# Altium project logi-cam-mt9v.PrjPcb
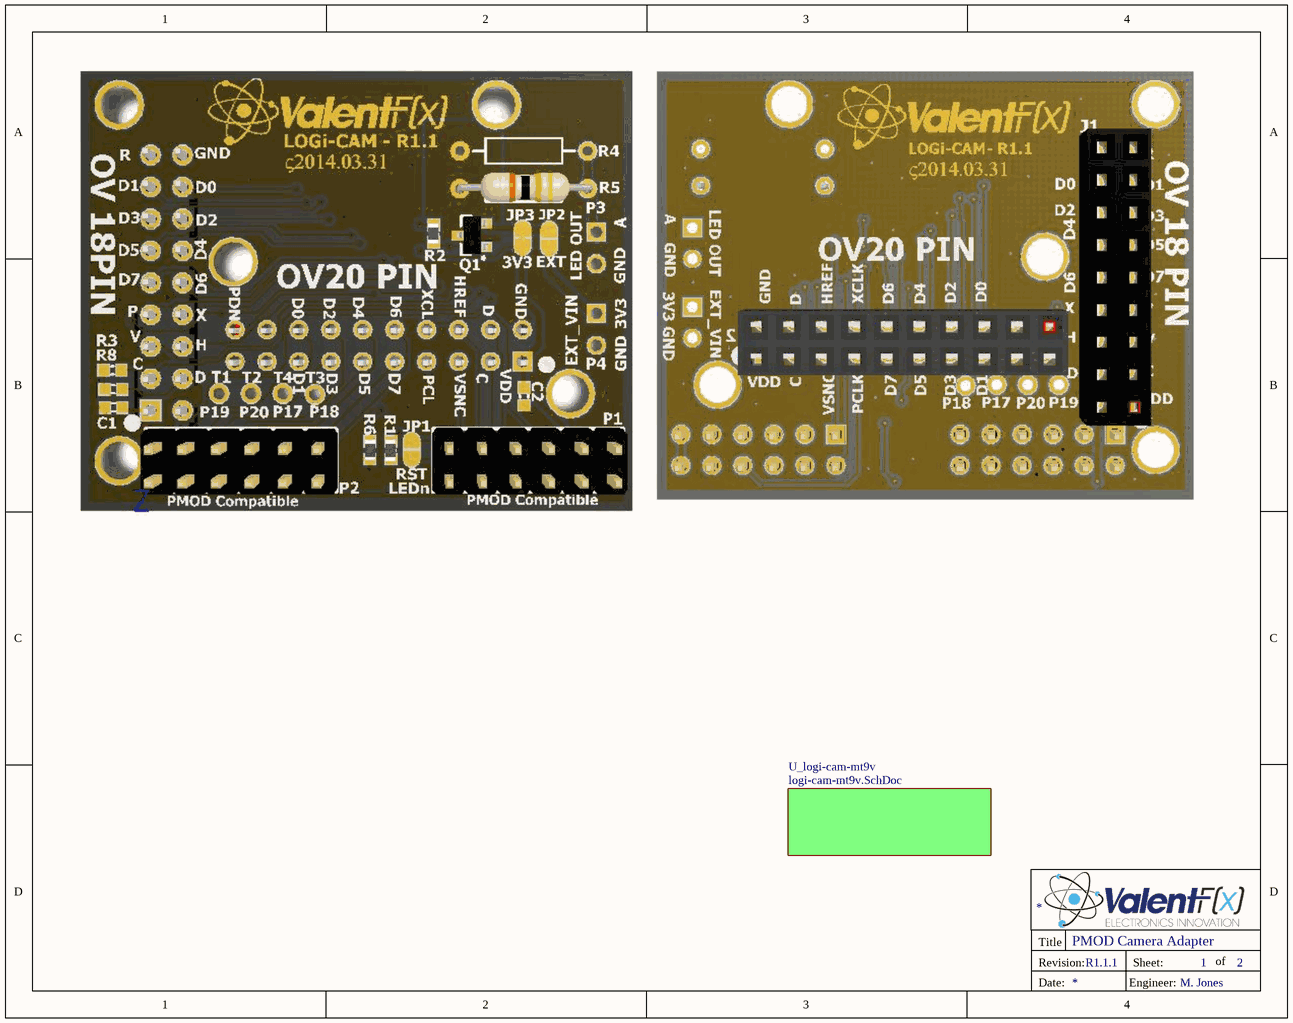
[diagram p0: logi-cam-mt9v-top.SchDoc]
PrjEngineer: M. Jones; PrjRevision: R1.1.1
2 sheets, 44 parts. Net scope: global (net labels, ports and power ports of the same name join across sheets).
Board file: logi-cam-mt9v.PcbDoc
Sheets:
  logi-cam-mt9v-top.SchDoc
    U_logi-cam-mt9v = logi-cam-mt9v.SchDoc

## Sheet logi-cam-mt9v-top.SchDoc: PMOD Camera Adapter
size A; Engineer: Michael Jones; DocumentNumber: 1; Revision: RA.1; SheetNumber: 1; SheetTotal: 2; ProjectName: OV7725

### Sub-sheets
U_logi-cam-mt9v = logi-cam-mt9v.SchDoc: no entries

### Notes on the sheet
- Title
- Revision:
- Sheet:
- of
- Date:
- Engineer:

## Sheet logi-cam-mt9v.SchDoc: PMOD Camera Adapter
size B; Engineer: Michael Jones; DocumentNumber: 2; Revision: RA.1; SheetNumber: 2; SheetTotal: 2; ProjectName: OV7725
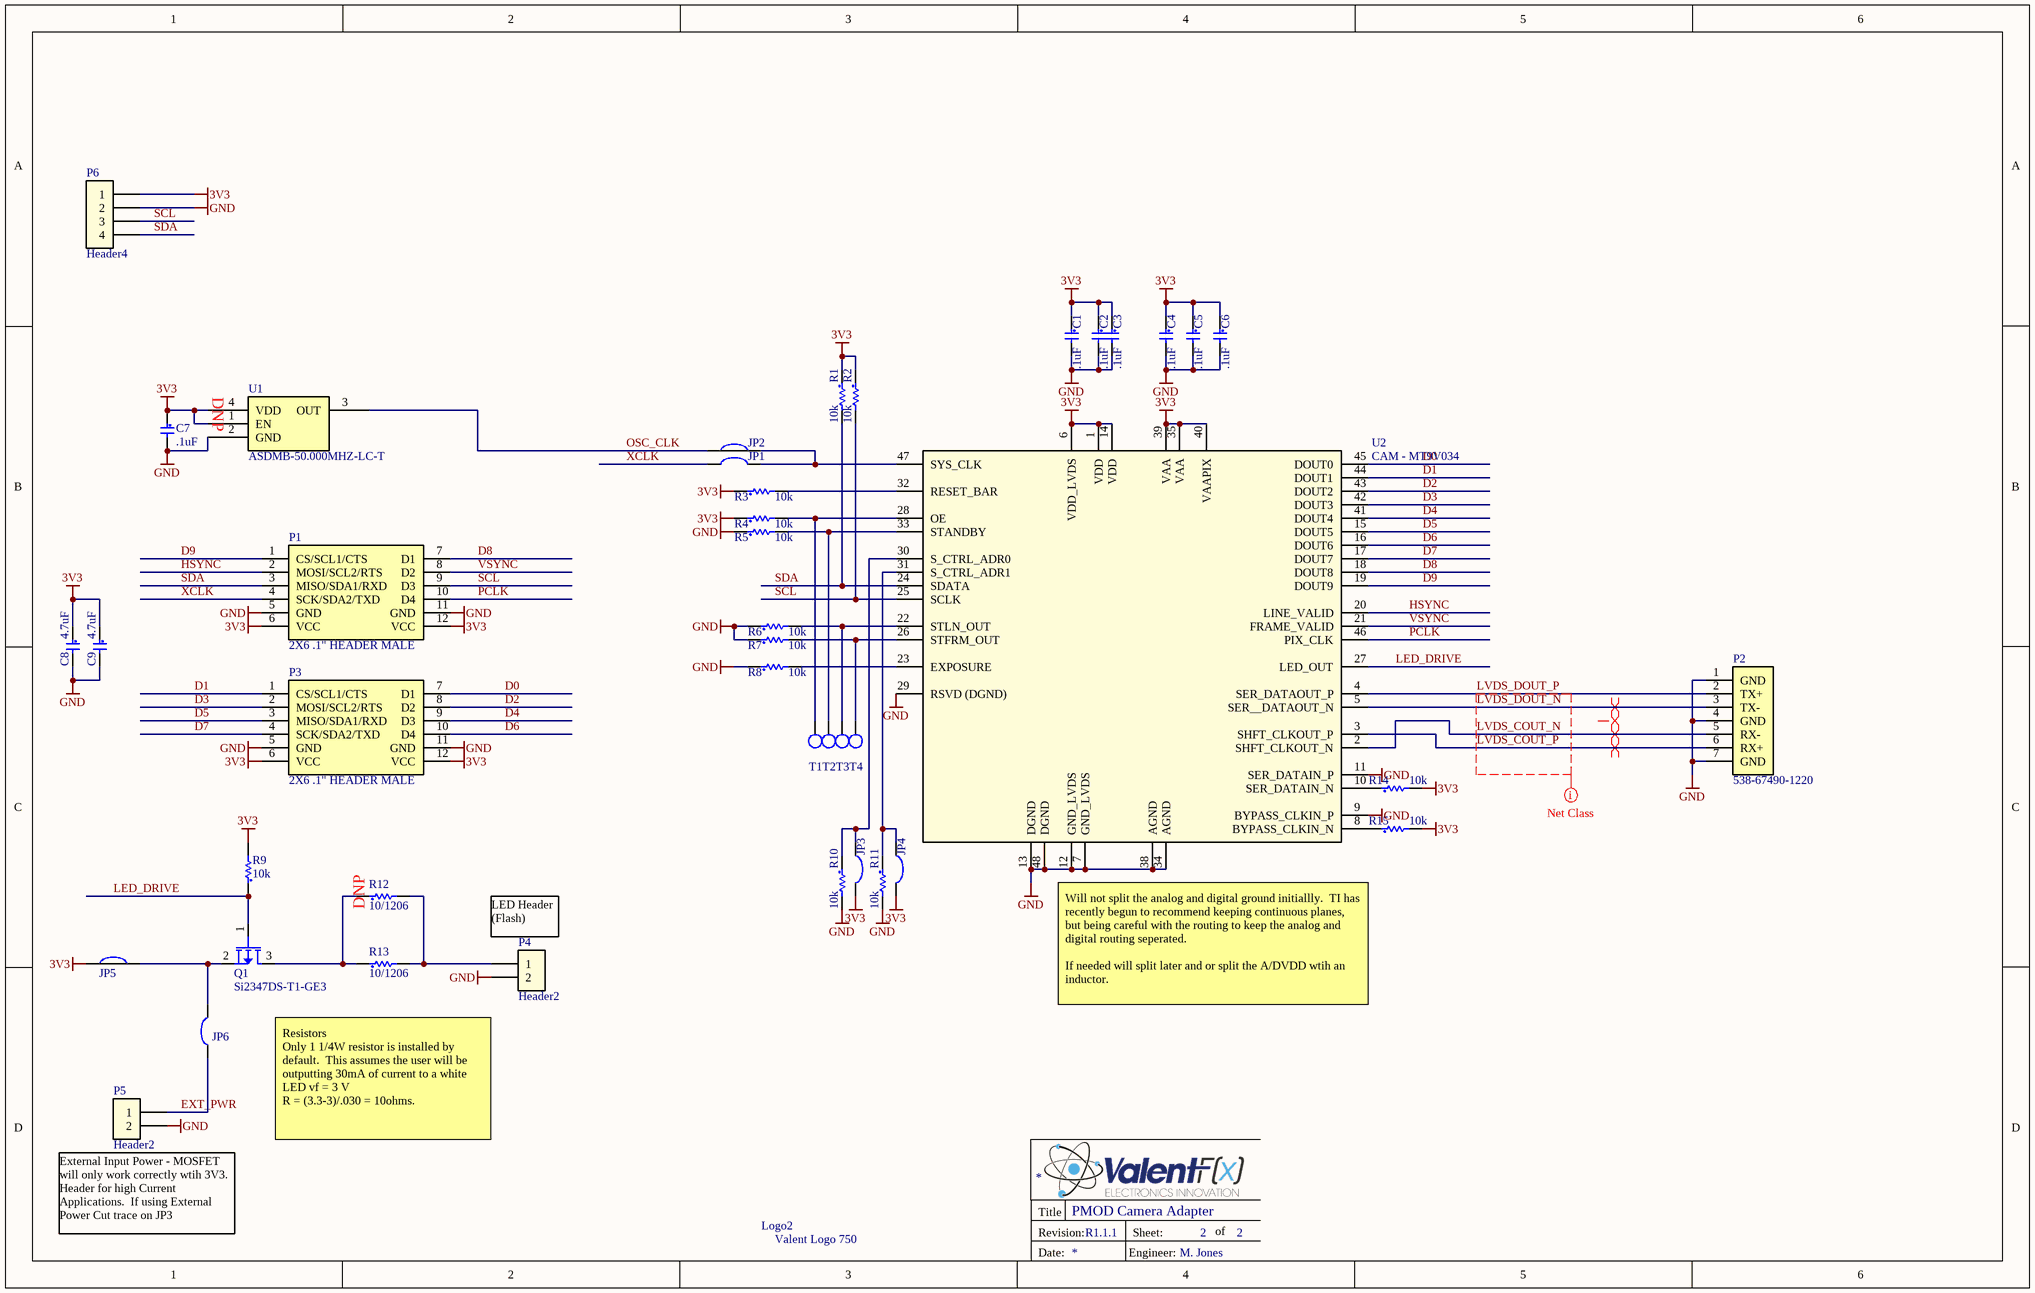
[diagram p1: logi-cam-mt9v.SchDoc]

### Parts
C1  .1uF  [C0603]
C2  .1uF  [C0603]
C3  .1uF  [C0603]
C4  .1uF  [C0603]
C5  .1uF  [C0603]
C6  .1uF  [C0603]
C7  .1uF  [C0603]
C8  4.7uF  [C0603 - Marked]
C9  4.7uF  [C0603 - Marked]
JP1  Solder Jumper  [SOLDER_JUMPER]  (value not drawn)  (no BOM)
JP2  Solder Jumper-NC  [SOLDER_JUMPER-NC]  (value not drawn)  (net tie, no BOM)
JP3  Solder Jumper  [SOLDER_JUMPER]  (value not drawn)  (no BOM)
JP4  Solder Jumper  [SOLDER_JUMPER]  (value not drawn)  (no BOM)
JP5  Solder Jumper-NC  [SOLDER_JUMPER-NC]  (value not drawn)  (net tie, no BOM)
JP6  Solder Jumper  [SOLDER_JUMPER]  (value not drawn)  (no BOM)
Logo2  Valent Logo 750  [VALENTFX_750-SolderMask-BOT]  (no BOM)
P1  2X6 .1" HEADER MALE  [PMOD HEADER - Male Vertical]
P2  Supplier Part Number 1: 538-67490-1220  [SATA - 67490-3220]  (hidden comment: SATA - 67490-1220)
P3  2X6 .1" HEADER MALE  [PMOD HEADER - Male Vertical]
P4  Header2  [HEADER_2_40_100 THRU SIP]  (no BOM)
P5  Header2  [HEADER_2_40_100 THRU SIP]  (no BOM)
P6  Header4  [HEADER_4_40_100 THRU SIP - duplicate]
Q1  Si2347DS-T1-GE3  [sot-23]
R1  10k  [R0603]
R2  10k  [R0603]
R3  10k  [R0603]
R4  10k  [R0603]
R5  10k  [R0603]
R6  10k  [R0603]
R7  10k  [R0603]
R8  10k  [R0603]
R9  10k  [R0603]
R10  10k  [R0603]
R11  10k  [R0603]
R12  10/1206  [R1206]
R13  10/1206  [R1206]
R14  10k  [R0603]
R15  10k  [R0603]
T1  Test Point  [Tp 18-33]  (value not drawn)  (no BOM)
T2  Test Point  [Tp 18-33]  (value not drawn)  (no BOM)
T3  Test Point  [Tp 18-33]  (value not drawn)  (no BOM)
T4  Test Point  [Tp 18-33]  (value not drawn)  (no BOM)
U1  ASDMB-50.000MHZ-LC-T  [ASDMB - osc]
U2  CAM - MT9V034  [CAM - MT9V034 - easier]

### Nets
3V3: C1.1 C2.1 C3.1 C4.1 C5.1 C6.1 C7.1 C8.1 C9.1 JP3.2 JP4.2 JP5.1 P1.6(VCC) P1.12(VCC) P3.6(VCC) P3.12(VCC) P6.1 R1.1 R2.1 R3.1 R4.1 R9.2 R14.2 R15.2 U1.1(EN) U1.4(VDD) U2.1(VDD) U2.6(VDD_LVDS) U2.14(VDD) U2.35(VAA) U2.39(VAA) U2.40(VAAPIX)
GND: C1.2 C2.2 C3.2 C4.2 C5.2 C6.2 C7.2 C8.2 C9.2 P1.5(GND) P1.11(GND) P2.1(GND) P2.4(GND) P2.7(GND) P3.5(GND) P3.11(GND) P4.2 P5.2 P6.2 R5.1 R6.1 R7.1 R8.1 R10.2 R11.2 U1.2(GND) U2.7(GND_LVDS) U2.9(BYPASS_CLKIN_P) U2.11(SER_DATAIN_P) U2.12(GND_LVDS) U2.13(DGND) U2.29(RSVD_(DGND)) U2.34(AGND) U2.38(AGND) U2.48(DGND)
D0: P3.7(D1) U2.45(DOUT0)
D1: P3.1(CS/SCL1/CTS) U2.44(DOUT1)
D2: P3.8(D2) U2.43(DOUT2)
D3: P3.2(MOSI/SCL2/RTS) U2.42(DOUT3)
D4: P3.9(D3) U2.41(DOUT4)
D5: P3.3(MISO/SDA1/RXD) U2.15(DOUT5)
D6: P3.10(D4) U2.16(DOUT6)
D7: P3.4(SCK/SDA2/TXD) U2.17(DOUT7)
D8: P1.7(D1) U2.18(DOUT8)
D9: P1.1(CS/SCL1/CTS) U2.19(DOUT9)
EXT_PWR: JP6.1 P5.1
HSYNC: P1.2(MOSI/SCL2/RTS) U2.20(LINE_VALID)
LED_DRIVE: Q1.1(G) R9.1 U2.27(LED_OUT)
LVDS_COUT_N: P2.5(RX-) U2.2(SHFT_CLKOUT_N)
LVDS_COUT_P: P2.6(RX+) U2.3(SHFT_CLKOUT_P)
LVDS_DOUT_N: P2.3(TX-) U2.5(SER__DATAOUT_N)
LVDS_DOUT_P: P2.2(TX+) U2.4(SER_DATAOUT_P)
OSC_CLK: JP2.1 U1.3(OUT)
PCLK: P1.10(D4) U2.46(PIX_CLK)
SCL: P1.9(D3) P6.3 R2.2 U2.25(SCLK)
SDA: P1.3(MISO/SDA1/RXD) P6.4 R1.2 U2.24(SDATA)
VSYNC: P1.8(D2) U2.21(FRAME_VALID)
XCLK: JP1.1 P1.4(SCK/SDA2/TXD)
NetJP1_2: JP1.2 JP2.2 U2.47(SYS_CLK)
NetJP3_1: JP3.1 R10.1 U2.30(S_CTRL_ADR0)
NetJP4_1: JP4.1 R11.1 U2.31(S_CTRL_ADR1)
NetJP5_2: JP5.2 JP6.2 Q1.2(S)
NetP4_1: P4.1 R12.2 R13.2
NetQ1_3: Q1.3(D) R12.1 R13.1
NetR3_2: R3.2 U2.32(RESET_BAR)
NetR4_2: R4.2 T1.1 U2.28(OE)
NetR5_2: R5.2 T2.1 U2.33(STANDBY)
NetR6_2: R6.2 T3.1 U2.22(STLN_OUT)
NetR7_2: R7.2 T4.1 U2.26(STFRM_OUT)
NetR8_2: R8.2 U2.23(EXPOSURE)
NetR14_1: R14.1 U2.10(SER_DATAIN_N)
NetR15_1: R15.1 U2.8(BYPASS_CLKIN_N)

### Layout directives
net class Undefined: LVDS_COUT_N, LVDS_COUT_P, LVDS_DOUT_N, LVDS_DOUT_P
differential pair: (no net found under the mark), LVDS_COUT_N, LVDS_COUT_P, LVDS_DOUT_N

### Notes on the sheet
- (near U1) DNP
- (near R12) DNP
- (near P4) LED Header
  (Flash)
- Will not split the analog and digital ground initiallly.  TI has recently begun to recommend keeping continuous planes, but being careful with the routing to keep the analog and digital routing seperated.
  If needed will split later and or split the A/DVDD wtih an inductor.
- Resistors
  Only 1 1/4W resistor is installed by default.  This assumes the user will be outputting 30mA of current to a white LED vf = 3 V
  R = (3.3-3)/.030 = 10ohms.
- (near P5) External Input Power - MOSFET will only work correctly wtih 3V3.  Header for high Current Applications.  If using External Power Cut trace on JP3
- Title
- Revision:
- Sheet:
- of
- Date:
- Engineer:

### Library data of the parts
C1-C7 = C0603 - C1608X7R1E104MT: .10uF X7R 20% (MLCC) - SMD/SMT 0603 25volts; Manufacturer: TDK; Capacitance: 0.1 uF; Supplier 1: Mouser; Manufacturer Part Number: C1608X7R1E104MT; RoHS: RoHS Compliant By Exemption; Category: Multilayer Ceramic Capacitors (MLCC) - SMD/SMT; Stock 1: 69148; Pricing 1: 1=0.365, 50=0.149, 100=0.085, 500=0.045, 1000=0.030, 4000=0.027, 8000=0.023, 12000=0.019, 20000=0.018 (AUD); Dimensions: 0.8 mm W x 1.6 mm L; Operating Temperature Range: - 55 C to + 125 C; Package / Case: 0603 (1608 metric); Packaging: Reel; Product: General Type MLCCs; Termination Style: SMD/SMT; Tolerance: 20 %; Voltage Rating: 25 Volts; Product Category: Low & Medium Capacitance SMD Ceramic Chip Capacitors; Standard Pack Qty: 4000.0; Temperature Coefficient / Code: X7R; RoHS - Mouser: E; Minimum Order Quantity: 1; Reeling: True; ComponentLink1URL: http://www.tdk.co.jp/tefe02/e411_c.pdf; ComponentLink1Description: http://www.tdk.co.jp/tefe02/e411_c.pdf; Supplier Part Number 1: 810-C1608X7R1E104M; Value: .1uF
C8 C9 = C0603 - GRM188R60J475KE19D: 4.7uF 6.3volts X5R 10% (MLCC) - SMD/SMT 0603; Manufacturer: Murata Electronics North America; Capacitance: 4.7µF; Voltage - Rated: 6.3V; Value: 4.7uF; Supplier 1: Digi-Key; Supplier Part Number 1: 490-3297-1-ND; Manufacturer Part Number: GRM188R60J475KE19D; RoHS: RoHS Compliant; Category: Capacitors; Stock 1: 614848; Pricing 1: 1=0.19, 10=0.132, 50=0.076, 100=0.0627, 250=0.05284, 500=0.04426, 1000=0.03633 (USD); Tolerance: ±10%; Package / Case: 0603 (1608 Metric); Packaging: Cut Tape (CT); ComponentLink1URL: http://search.murata.co.jp/Ceramy/image/img/PDF/ENG/GRM188R60J475KE19.pdf; ComponentLink1Description: http://search.murata.co.jp/Ceramy/image/img/PDF/ENG/GRM188R60J475KE19.pdf; Temperature Coefficient: X5R; Mounting Type: Surface Mount, MLCC; Operating Temperature: -55°C ~ 85°C; Applications: General Purpose; Ratings: -; Size / Dimension: 0.063" L x 0.031" W (1.60mm x 0.80mm); Height - Seated (Max): -; Thickness (Max): 0.035" (0.90mm); Lead Spacing: -; Features: -; Lead Style: -
JP1 JP3 JP4 JP6 = Solder Jumper: Solder/Configuration Jumper; Manufacturer: n/a; Manufacturer Part Number: n/a; Source: n/a; Source Part Number: n/a; ROHS Certificate: n/a
JP2 JP5 = Solder Jumper-NC: Solder/Configuration Jumper; Manufacturer: n/a; Manufacturer Part Number: n/a; Source: n/a; Source Part Number: n/a; ROHS Certificate: n/a
P1 P3 = P-MOD - PRPC006DAAN-RC: CONN HEADER .100" DUAL STR 12 POS; Manufacturer: Sullins Connector Solutions; Connector Type: Header, Unshrouded; Number of Positions: 12; Number of Positions Loaded: All; Pitch: 0.100" (2.54mm); Supplier 1: Digi-Key; Manufacturer Part Number: PRPC006DAAN-RC; RoHS: RoHS Compliant; Category: Connectors, Interconnects; Stock 1: 0; Pricing 1: 1=0.46, 10=0.41, 100=0.3378, 500=0.26702, 1000=0.22923, 5000=0.20912, 10000=0.20108 (USD); Packaging: Bulk; Contact Type: Male Pin; Number of Rows: 2; Row Spacing: 0.100" (2.54mm); Contact Mating Length: 0.230" (5.84mm); Mounting Type: Through Hole; Termination: Solder; Fastening Type: -; Features: -; Contact Finish: Gold; Contact Finish Thickness: Flash; Color: Black; ComponentLink1URL: http://media.digikey.com/PDF/Data%20Sheets/Sullins%20PDFs/xRxCzzzDxxN-RC_11636-B.pdf; ComponentLink1Description: http://media.digikey.com/PDF/Data%20Sheets/Sullins%20PDFs/xRxCzzzDxxN-RC_11636-B.pdf; Supplier Part Number 1: S2011EC-06-ND; Value: 2X6 .1" HEADER MALE
P2 = SATA - 67490-1220: SATA Data - 67490-1220; Manufacturer: Molex; 1Notes: looks more standard need, different footprint; Gender: Male; Pitch: 1.27 mm; Number of Positions / Contacts: 7; Supplier 1: Mouser; Manufacturer Part Number: 67490-1220; RoHS: RoHS Compliant; Category: I/O Connectors; Stock 1: 475; Pricing 1: 1=1.28, 10=1.07, 100=0.792, 500=0.640, 1000=0.572, 2000=0.525 (AUD); Packaging: Tray; Product: SATA Connectors; Termination Style: Solder Terminal; Mounting Style: SMD/SMT; Product Category: 1.27mm Connectors; Standard Pack Qty: 2880; RoHS - Mouser: Y; Minimum Order Quantity: 1; Reeling: False; ComponentLink1URL: http://www.molex.com/webdocs/datasheets/pdf/en-us/0674901220_PCB_HEADERS.pdf; ComponentLink1Description: http://www.molex.com/webdocs/datasheets/pdf/en-us/0674901220_PCB_HEADERS.pdf
P4 P5 = Header2: Header 2 pin
P6 = Header4: Header 4 pin
Q1 = PMOS - Si2347DS-T1-GE3: MOSFET -30V .042Ohm@10V 5A P-Ch G-III; Manufacturer: Vishay Semiconductors; Accept Compatible Replacement Part: Yes; Configuration: Single; Continuous Drain Current: - 3.9 A; Forward Transconductance - Min: 10 S; Gate-Source Breakdown Voltage: 20 V; Power Dissipation: 1.7 W; Rds On: 68 mOhms; Transistor Polarity: P-Channel; Fall Time: 9 ns; Gate Charge Qg: 6.9 nC; Rise Time: 6 ns; Typical Turn-Off Delay Time: 19 ns; Product Status: New Product; Supplier 1: Mouser; Manufacturer Part Number: Si2347DS-T1-GE3; RoHS: RoHS Compliant; Category: MOSFET; Stock 1: 8482; Pricing 1: 1=0.203, 10=0.189, 100=0.135, 250=0.122, 500=0.108, 3000=0.095 (AUD); Package / Case: SOT-23-3; Packaging: Reel; Drain-Source Breakdown Voltage: - 30 V; Mounting Style: SMD/SMT; Maximum Operating Temperature: + 150 C; Minimum Operating Temperature: - 55 C; Product Category: P-Channel MOSFETs; Standard Pack Qty: 3000; RoHS - Mouser: Y; Minimum Order Quantity: 1; Reeling: True; ComponentLink1URL: http://www.mouser.com/ds/2/427/si2347ds-279626.pdf; ComponentLink1Description: http://www.mouser.com/ds/2/427/si2347ds-279626.pdf; Supplier Part Number 1: 78-SI2347DS-T1-GE3
R1-R11 R14 R15 = R0603 - CRCW060310K0FKEA: 10k Thick Film Resistors - SMD 1/10watt 10Kohms 1%; Manufacturer: Vishay Dale; Power (Watts): 0.1W, 1/10W; Temperature Coefficient: ±100ppm/°C; Supplier 1: Digi-Key; Manufacturer Part Number: CRCW060310K0FKEA; RoHS: RoHS Compliant; Category: Resistors; Stock 1: 997856; Pricing 1: 10=0.081, 50=0.0436, 200=0.0251, 1000=0.01711 (USD); Resistance (Ohms): 10K; Composition: Thick Film; Features: -; Tolerance: ±1%; Package / Case: 0603 (1608 Metric); Size / Dimension: 0.061" L x 0.033" W (1.55mm x 0.85mm); Height: 0.020" (0.50mm); Number of Terminations: 2; Packaging: Cut Tape (CT); ComponentLink1URL: http://www.vishay.com/doc?20035; ComponentLink1Description: http://www.vishay.com/doc?20035; Supplier Part Number 1: 541-10.0KHCT-ND; Value: 10k
R12 R13 = R1206 - ERJ-8ENF3301V: RES 3.3K OHM 1/4W 1% 1206 SMD; Manufacturer: Panasonic Electronic Components; Accept Compatible Replacement Part: Yes; Power (Watts): 0.25W, 1/4W; Temperature Coefficient: ±100ppm/°C; Supplier 1: Digi-Key; Manufacturer Part Number: ERJ-8ENF3301V; RoHS: RoHS Compliant; Category: Resistors; Stock 1: 147970; Pricing 1: 1=0.1, 50=0.0368, 100=0.028, 250=0.0208, 500=0.01536, 1000=0.01024 (USD); Packaging: Digi-Reel®; Resistance (Ohms): 3.3k; Tolerance: ±1%; Composition: Thick Film; Features: -; Package / Case: 1206 (3216 Metric); Supplier Device Package: 1206; Size / Dimension: 0.126" L x 0.063" W (3.20mm x 1.60mm); Height: 0.028" (0.70mm); Number of Terminations: 2; ComponentLink1URL: http://industrial.panasonic.com/www-cgi/jvcr13pz.cgi?E+PZ+3+AOA0002+ERJ8ENF3301V+7+WW; ComponentLink1Description: http://industrial.panasonic.com/www-cgi/jvcr13pz.cgi?E+PZ+3+AOA0002+ERJ8ENF3301V+7+WW; Supplier Part Number 1: P3.30KFDKR-ND; Value: 3.3k
T1-T4 = Test Point 2: Test Point Smaller Symbol
U1 = ASDMB-50.000MHZ-LC-T: OSC MEMS 50.000 MHZ SMD; Manufacturer: Abracon Corporation; Frequency: 50MHz; Function: Tri-State (Output Enable); Output: CMOS; Voltage - Supply: 1.8 V ~ 3.3 V; Frequency Stability: ±50ppm; Current - Supply (Max): 16mA; Current - Supply (Disable) (Max): 15µA; Supplier 1: Digi-Key; Manufacturer Part Number: ASDMB-50.000MHZ-LC-T; RoHS: RoHS Compliant; Category: Crystals and Oscillators; Stock 1: 967; Pricing 1: 1=1.69, 10=1.463, 50=1.2826, 100=1.0125, 500=0.855 (USD); Type: MEMS (Silicon); Operating Temperature: -40°C ~ 85°C; Mounting Type: Surface Mount; Size / Dimension: 0.098" L x 0.079" W (2.50mm x 2.00mm); Height: 0.035" (0.90mm); Package / Case: 4-SMD, No Lead (DFN, LCC); Packaging: Cut Tape (CT); ComponentLink1URL: http://www.abracon.com/Oscillators/ASDMB.pdf; ComponentLink1Description: http://www.abracon.com/Oscillators/ASDMB.pdf; Supplier Part Number 1: 535-11738-1-ND; Value: ASDMB-50.000MHZ-LC-T
U2 = CAM - MT9V034: SENSOR IMAGE VGA MONO 48-CLCC; Manufacturer: Aptina LLC; Manufacturer Part Number: MT9V034C12STM; Pixel Size: 6µm x 6µm; Active Pixel Array: 752H x 480V; Frames per Second: 60; Voltage - Supply: 3.3V; Supplier 1: Digi-Key; RoHS: RoHS Compliant; Category: Sensors, Transducers; Stock 1: 0; Pricing 1: 152=14.4925 (USD); Packaging: Tray; Type: CMOS Imaging; Package / Case: 48-CLCC; Supplier Device Package: 48-CLCC; Note: *; ComponentLink1URL: http://media.digikey.com/pdf/Data%20Sheets/APTINA%20PDFs/MT9V034.pdf; ComponentLink1Description: http://media.digikey.com/pdf/Data%20Sheets/APTINA%20PDFs/MT9V034.pdf; Supplier Part Number 1: 557-1454-ND

## Assembly variants
MFG: not fitted C1 C2 R3 R4 R8
Complete: all parts fitted